# EasyEDA schematic 1-Schematic_EMWAVER_V1.0.1.json
TITLE: Sheet_1; REV: 1.0; Date: 2022-12-25; Sheet: 1/1; Drawn By: maarnotto; Company: Your Company
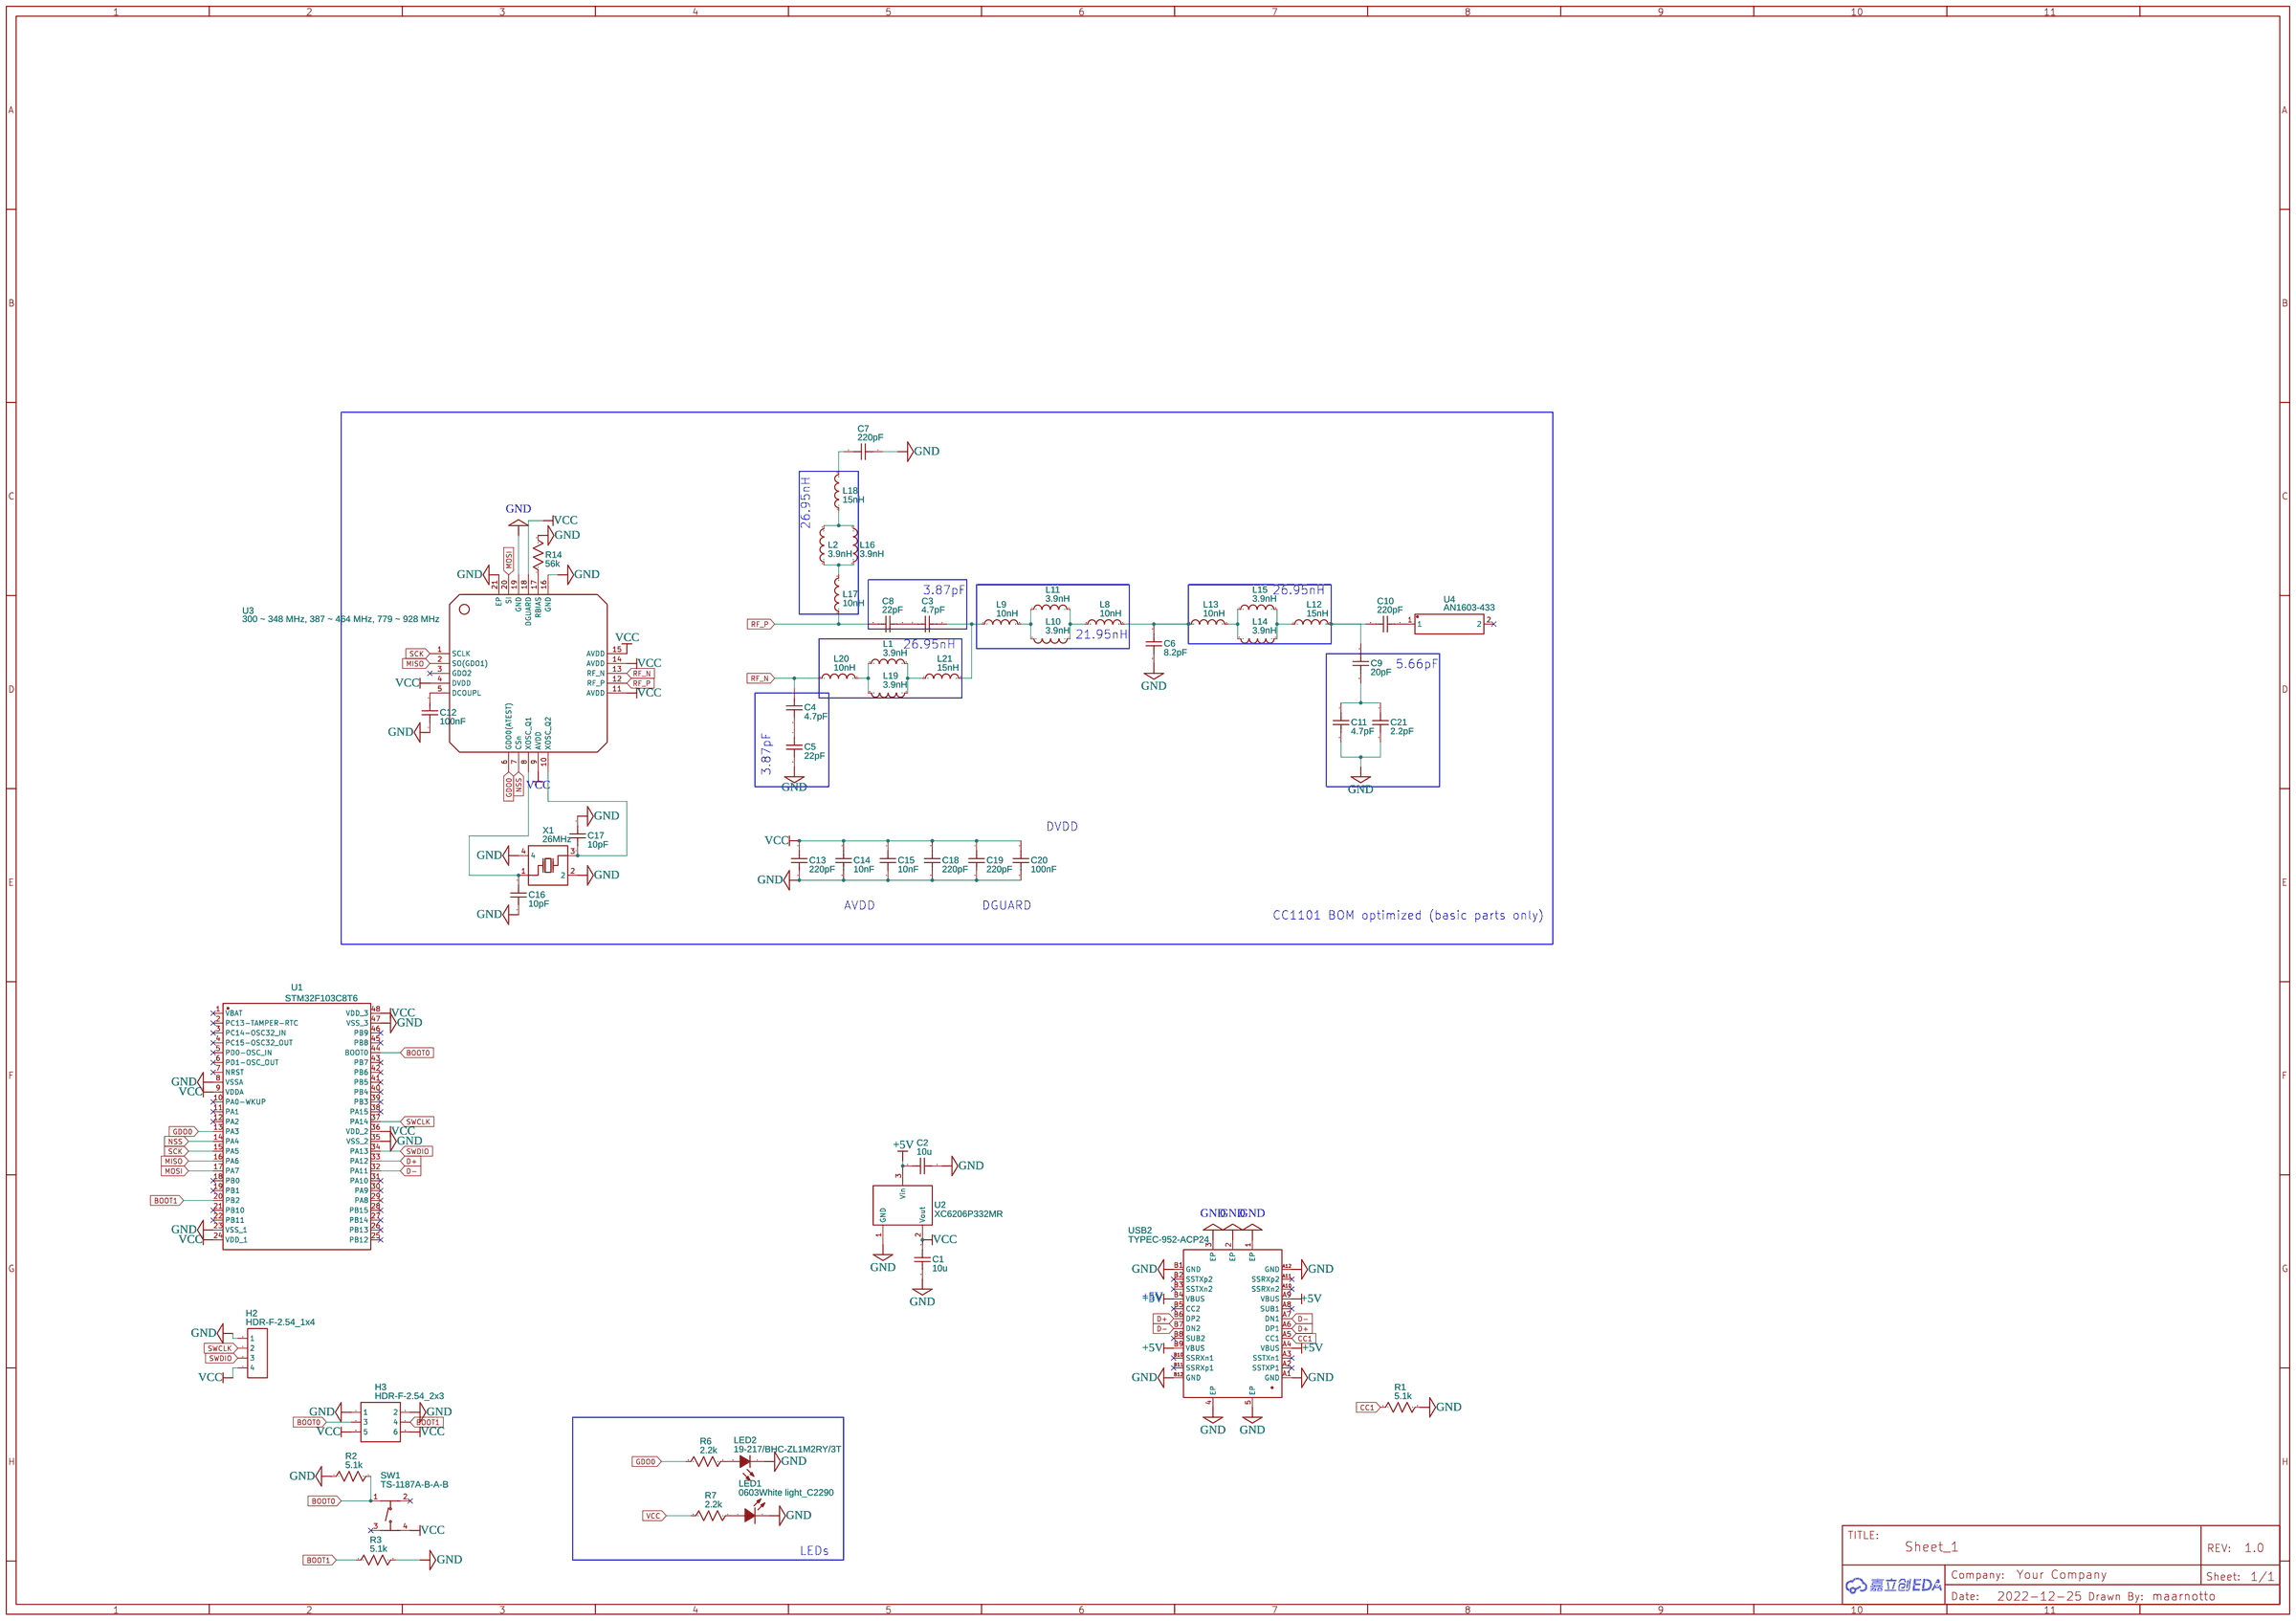
[diagram p0: schematic sheet]

## Parts
C1  10u  [C0603]
C2  10u  [C0603]
C3  4.7pF  [C0402]
C4  4.7pF  [C0402]
C5  22pF  [C0402]
C6  8.2pF  [C0603]
C7  220pF  [C0402]
C8  22pF  [C0402]
C9  20pF  [C0402]
C10  220pF  [C0402]
C11  4.7pF  [C0402]
C12  100nF  [C0402]
C13  220pF  [C0402]
C14  10nF  [C0402]
C15  10nF  [C0402]
C16  10pF  [C0402]
C17  10pF  [C0402]
C18  220pF  [C0402]
C19  220pF  [C0402]
C20  100nF  [C0402]
C21  2.2pF  [C0402]
H2  HDR-F-2.54_1x4  [HDR-F-2.54_1X4]
H3  HDR-F-2.54_2x3  [HDR-F-2.54_2X3]
L1  3.9nH  [L0402]
L2  3.9nH  [L0402]
L8  10nH  [L0402]
L9  10nH  [L0402]
L10  3.9nH  [L0402]
L11  3.9nH  [L0402]
L12  15nH  [L0402]
L13  10nH  [L0402]
L14  3.9nH  [L0402]
L15  3.9nH  [L0402]
L16  3.9nH  [L0402]
L17  10nH  [L0402]
L18  15nH  [L0402]
L19  3.9nH  [L0402]
L20  10nH  [L0402]
L21  15nH  [L0402]
LED1  0603White light_C2290  [LED0603-R-RD_WHITE]
LED2  19-217/BHC-ZL1M2RY/3T  [LED0603-RD]
R1  5.1k  [R0603]
R2  5.1k  [R0603]
R3  5.1k  [R0603]
R6  2.2k  [R0603]
R7  2.2k  [R0603]
R14  56k  [R0402]
SW1  TS-1187A-B-A-B  [SW-SMD_4P-L5.1-W5.1-P3.70-LS6.5-TL-2]
U1  STM32F103C8T6  [LQFP-48_L7.0-W7.0-P0.50-LS9.0-BL]
U2  XC6206P332MR  [SOT-23-3_L2.9-W1.6-P1.90-LS2.8-BR]
U3  300 ~ 348 MHz, 387 ~ 464 MHz, 779 ~ 928 MHz  [QFN-20_L4.0-W4.0-P0.5-TL-EP]
U4  AN1603-433  [ANT-SMD_L16.0-W3.1]
USB2  TYPEC-952-ACP24  [USB-C-SMD_TYPEC-952-ACP24]
X1  26MHz  [CRYSTAL-SMD_4P-L3.2-W2.5-BL]

## Library data of the parts
C1 C2 C6 = C_0603_US: Contributor: LCEDA_Lib
C3-C5 C7-C21 = C_0402_US: Contributor: LCEDA_Lib
H2 = HDR-F-2.54_1x4: Supplier Part: C225501; Supplier: LCSC; Contributor: LCEDA_Lib
H3 = HDR-F-2.54_2x3: Supplier Part: C65114; Supplier: LCSC; Contributor: LCEDA_Lib
L1 L2 L10 L11 L14-L16 L19 = L0402_US: Supplier Part: C14033; Contributor: LCEDA_Lib
L8 L9 L13 L17 L20 = L0402_US: Supplier Part: C27147; Contributor: LCEDA_Lib
L12 L18 L21 = L0402_US: Supplier Part: C27143; Contributor: LCEDA_Lib
LED1 = 0603White light_C2290: Supplier: LCSC; Manufacturer: null; Manufacturer Part: KT-0603白灯; Supplier Part: C2290; JLCPCB Part Class: Basic Part
LED2 = 19-217/BHC-ZL1M2RY/3T: Supplier: LCSC; Manufacturer: EVERLIGHT(亿光); Supplier Part: C72041; JLCPCB Part Class: Basic Part
R1-R3 R6 R7 = R_0603_US: Contributor: LCEDA_Lib
R14 = R_0402_US: Contributor: LCEDA_Lib
SW1 = TS-1187A-B-A-B: Supplier: LCSC; Supplier Part: C318884; Manufacturer: XKB Connectivity(中国星坤); Contributor: LCSC; JLCPCB Part Class: Basic Part
U1 = STM32F103C8T6: Supplier: LCSC; Manufacturer: ST(意法半导体); Supplier Part: C8734; JLCPCB Part Class: Basic Part
U2 = XC6206P332MR: Supplier: LCSC; Manufacturer: TOREX(特瑞仕); Supplier Part: C5446; JLCPCB Part Class: Basic Part
U3 = CC1101RGPR: Supplier: LCSC; Manufacturer: TI(德州仪器); Supplier Part: C29953; JLCPCB Part Class: Extended Part
U4 = AN1603-433: Supplier: LCSC; Supplier Part: C122806; Manufacturer: rainsun(霖昱微); Contributor: LCSC; JLCPCB Part Class: Extended Part
USB2 = TYPEC-952-ACP24: Supplier: LCSC; Supplier Part: C2840398; Manufacturer: XUNPU(讯普); Contributor: LCSC; JLCPCB Part Class: Extended Part
X1 = 3S26000333: Supplier: LCSC; Supplier Part: C431163; Manufacturer: YL(惠伦晶体); Contributor: LCSC; JLCPCB Part Class: Extended Part

## Nets
+5V: C2.2 U2.3(Vin) USB2.A4(VBUS) USB2.A9(VBUS) USB2.B4(VBUS) USB2.B9(VBUS)
GND: C1.2 C2.1 C5.2 C6.2 C7.1 C11.2 C12.2 C13.2 C14.2 C15.2 C16.2 C17.2 C18.2 C19.2 C20.2 C21.2 H2.1 H3.1 H3.2 LED1.2(K) LED2.1(C) R1.2 R2.1 R3.2 R14.2 U1.8(VSSA) U1.23(VSS_1) U1.35(VSS_2) U1.47(VSS_3) U2.1(GND) U3.16(GND) U3.19(GND) U3.21(EP) USB2.1(EP) USB2.2(EP) USB2.3(EP) USB2.4(EP) USB2.5(EP) USB2.A1(GND) USB2.A12(GND) USB2.B1(GND) USB2.B12(GND) X1.2 X1.4
VCC: C1.1 C13.1 C14.1 C15.1 C18.1 C19.1 C20.1 H2.4 H3.5 H3.6 R7.1 SW1.4(D) U1.9(VDDA) U1.24(VDD_1) U1.36(VDD_2) U1.48(VDD_3) U2.2(Vout) U3.4(DVDD) U3.9(AVDD) U3.11(AVDD) U3.14(AVDD) U3.15(AVDD) U3.18(DGUARD)
BOOT0: H3.3 R2.2 SW1.1(A) U1.44(BOOT0)
BOOT1: H3.4 R3.1 U1.20(PB2)
CC1: R1.1 USB2.A5(CC1)
D+: U1.33(PA12) USB2.A6(DP1) USB2.B6(DP2)
D-: U1.32(PA11) USB2.A7(DN1) USB2.B7(DN2)
GDO0: R6.1 U1.13(PA3) U3.6(GDO0(ATEST))
MISO: U1.16(PA6) U3.2(SO(GDO1))
MOSI: U1.17(PA7) U3.20(SI)
NSS: U1.14(PA4) U3.7(CSn)
RF_N: C4.1 L20.1 U3.13(RF_N)
RF_P: C8.2 L17.1 U3.12(RF_P)
SCK: U1.15(PA5) U3.1(SCLK)
SWCLK: H2.2 U1.37(PA14)
SWDIO: H2.3 U1.34(PA13)
Net-(C3-1): C3.1 L9.1 L21.2
Net-(C3-2): C3.2 C8.1
Net-(C4-2): C4.2 C5.1
Net-(C6-1): C6.1 L8.2 L13.1
Net-(C7-2): C7.2 L18.2
Net-(C9-1): C9.1 C10.2 L12.2
Net-(C9-2): C9.2 C11.1 C21.1
Net-(C10-1): C10.1 U4.1
Net-(C12-1): C12.1 U3.5(DCOUPL)
Net-(C16-1): C16.1 U3.8(XOSC_Q1) X1.1(OSC1)
Net-(C17-1): C17.1 U3.10(XOSC_Q2) X1.3(OSC2)
Net-(L1-1): L1.1 L19.2 L20.2
Net-(L1-2): L1.2 L19.1 L21.1
Net-(L2-1): L2.1 L16.2 L17.2
Net-(L2-2): L2.2 L16.1 L18.1
Net-(L8-1): L8.1 L10.1 L11.2
Net-(L9-2): L9.2 L10.2 L11.1
Net-(L12-1): L12.1 L14.1 L15.2
Net-(L13-2): L13.2 L14.2 L15.1
Net-(LED1-1): LED1.1(A) R7.2
Net-(LED2-2): LED2.2(A) R6.2
Net-(R14-1): R14.1 U3.17(RBIAS)

Not connected (* = marked no-connect by the designer): SW1 2(B)* 3(C)*; U1 1(VBAT)* 2(PC13-TAMPER-RTC)* 3(PC14-OSC32_IN)* 4(PC15-OSC32_OUT)* 5(PD0-OSC_IN)* 6(PD1-OSC_OUT)* 7(NRST)* 10(PA0-WKUP)* 11(PA1)* 12(PA2)* 18(PB0)* 19(PB1)* 21(PB10)* 22(PB11)* 25(PB12)* 26(PB13)* 27(PB14)* 28(PB15)* 29(PA8)* 30(PA9)* 31(PA10)* 38(PA15)* 39(PB3)* 40(PB4)* 41(PB5)* 42(PB6)* 43(PB7)* 45(PB8)* 46(PB9)*; U3 3(GDO2)*; U4 2*; USB2 A2(SSTXP1)* A3(SSTXn1)* A8(SUB1)* A10(SSRXn2)* A11(SSRXp2)* B2(SSTXp2)* B3(SSTXn2)* B5(CC2)* B8(SUB2)* B10(SSRXn1)* B11(SSRXp1)*

## Notes on the sheet
- 26.95nH
- 3.87pF
- 26.95nH
- 21.95nH
- 26.95nH
- 5.66pF
- 3.87pF
- DVDD
- AVDD
- DGUARD
- CC1101 BOM optimized (basic parts only)
- +5V
- LEDs
